# EAGLE design Board v2 (EAGLE 9.6.2)
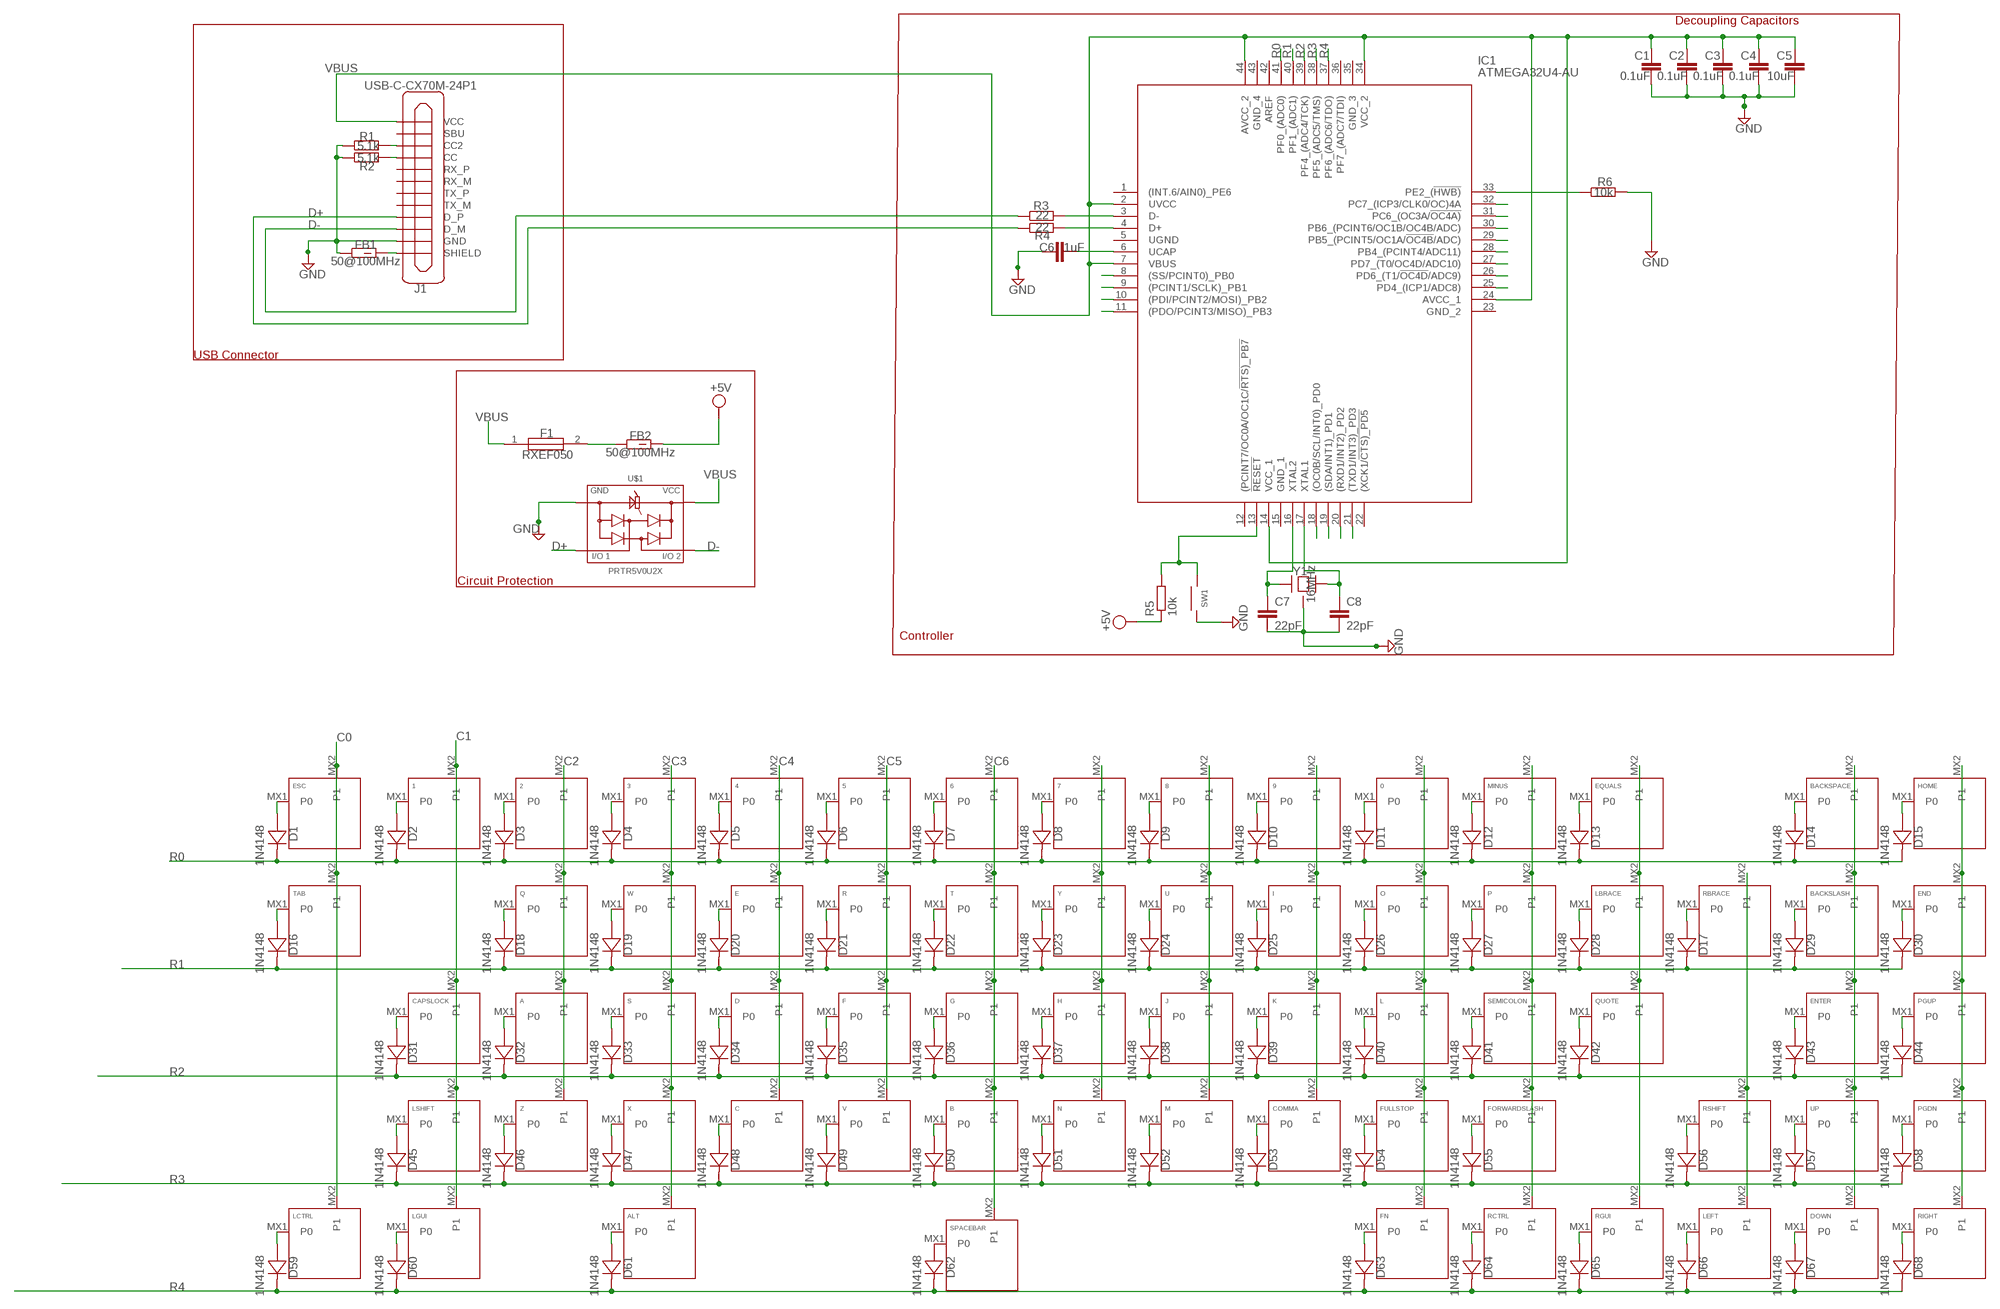
[diagram p0: schematic, sheet 1]

## Parts
0  KEYSWITCH-PLAIN-MX-1U  [MX-1U]
1  KEYSWITCH-PLAIN-MX-1U  [MX-1U]
2  KEYSWITCH-PLAIN-MX-1U  [MX-1U]
3  KEYSWITCH-PLAIN-MX-1U  [MX-1U]
4  KEYSWITCH-PLAIN-MX-1U  [MX-1U]
5  KEYSWITCH-PLAIN-MX-1U  [MX-1U]
6  KEYSWITCH-PLAIN-MX-1U  [MX-1U]
7  KEYSWITCH-PLAIN-MX-1U  [MX-1U]
8  KEYSWITCH-PLAIN-MX-1U  [MX-1U]
9  KEYSWITCH-PLAIN-MX-1U  [MX-1U]
A  KEYSWITCH-PLAIN-MX-1U  [MX-1U]
ALT  KEYSWITCH-PLAIN-MX-1U  [MX-1U]
B  KEYSWITCH-PLAIN-MX-1U  [MX-1U]
BACKSLASH  KEYSWITCH-PLAIN-MX-1U  [MX-1U]
BACKSPACE  KEYSWITCH-PLAIN-MX-2U  [MX-2U]
C  KEYSWITCH-PLAIN-MX-1U  [MX-1U]
C1  0.1uF  C2,5-3  [C2.5-3]
C2  0.1uF  C2,5-3  [C2.5-3]
C3  0.1uF  C2,5-3  [C2.5-3]
C4  0.1uF  C2,5-3  [C2.5-3]
C5  10uF  C2,5-3  [C2.5-3]
C6  1uF  C2,5-3  [C2.5-3]
C7  22pF  C2,5-3  [C2.5-3]
C8  22pF  C2,5-3  [C2.5-3]
CAPSLOCK  KEYSWITCH-PLAIN-MX-2U  [MX-2U]
COMMA  KEYSWITCH-PLAIN-MX-1U  [MX-1U]
D  KEYSWITCH-PLAIN-MX-1U  [MX-1U]
D1  1N4148  DIODE-DO-35  [DO-35]
D2  1N4148  DIODE-DO-35  [DO-35]
D3  1N4148  DIODE-DO-35  [DO-35]
D4  1N4148  DIODE-DO-35  [DO-35]
D5  1N4148  DIODE-DO-35  [DO-35]
D6  1N4148  DIODE-DO-35  [DO-35]
D7  1N4148  DIODE-DO-35  [DO-35]
D8  1N4148  DIODE-DO-35  [DO-35]
D9  1N4148  DIODE-DO-35  [DO-35]
D10  1N4148  DIODE-DO-35  [DO-35]
D11  1N4148  DIODE-DO-35  [DO-35]
D12  1N4148  DIODE-DO-35  [DO-35]
D13  1N4148  DIODE-DO-35  [DO-35]
D14  1N4148  DIODE-DO-35  [DO-35]
D15  1N4148  DIODE-DO-35  [DO-35]
D16  1N4148  DIODE-DO-35  [DO-35]
D17  1N4148  DIODE-DO-35  [DO-35]
D18  1N4148  DIODE-DO-35  [DO-35]
D19  1N4148  DIODE-DO-35  [DO-35]
D20  1N4148  DIODE-DO-35  [DO-35]
D21  1N4148  DIODE-DO-35  [DO-35]
D22  1N4148  DIODE-DO-35  [DO-35]
D23  1N4148  DIODE-DO-35  [DO-35]
D24  1N4148  DIODE-DO-35  [DO-35]
D25  1N4148  DIODE-DO-35  [DO-35]
D26  1N4148  DIODE-DO-35  [DO-35]
D27  1N4148  DIODE-DO-35  [DO-35]
D28  1N4148  DIODE-DO-35  [DO-35]
D29  1N4148  DIODE-DO-35  [DO-35]
D30  1N4148  DIODE-DO-35  [DO-35]
D31  1N4148  DIODE-DO-35  [DO-35]
D32  1N4148  DIODE-DO-35  [DO-35]
D33  1N4148  DIODE-DO-35  [DO-35]
D34  1N4148  DIODE-DO-35  [DO-35]
D35  1N4148  DIODE-DO-35  [DO-35]
D36  1N4148  DIODE-DO-35  [DO-35]
D37  1N4148  DIODE-DO-35  [DO-35]
D38  1N4148  DIODE-DO-35  [DO-35]
D39  1N4148  DIODE-DO-35  [DO-35]
D40  1N4148  DIODE-DO-35  [DO-35]
D41  1N4148  DIODE-DO-35  [DO-35]
D42  1N4148  DIODE-DO-35  [DO-35]
D43  1N4148  DIODE-DO-35  [DO-35]
D44  1N4148  DIODE-DO-35  [DO-35]
D45  1N4148  DIODE-DO-35  [DO-35]
D46  1N4148  DIODE-DO-35  [DO-35]
D47  1N4148  DIODE-DO-35  [DO-35]
D48  1N4148  DIODE-DO-35  [DO-35]
D49  1N4148  DIODE-DO-35  [DO-35]
D50  1N4148  DIODE-DO-35  [DO-35]
D51  1N4148  DIODE-DO-35  [DO-35]
D52  1N4148  DIODE-DO-35  [DO-35]
D53  1N4148  DIODE-DO-35  [DO-35]
D54  1N4148  DIODE-DO-35  [DO-35]
D55  1N4148  DIODE-DO-35  [DO-35]
D56  1N4148  DIODE-DO-35  [DO-35]
D57  1N4148  DIODE-DO-35  [DO-35]
D58  1N4148  DIODE-DO-35  [DO-35]
D59  1N4148  DIODE-DO-35  [DO-35]
D60  1N4148  DIODE-DO-35  [DO-35]
D61  1N4148  DIODE-DO-35  [DO-35]
D62  1N4148  DIODE-DO-35  [DO-35]
D63  1N4148  DIODE-DO-35  [DO-35]
D64  1N4148  DIODE-DO-35  [DO-35]
D65  1N4148  DIODE-DO-35  [DO-35]
D66  1N4148  DIODE-DO-35  [DO-35]
D67  1N4148  DIODE-DO-35  [DO-35]
D68  1N4148  DIODE-DO-35  [DO-35]
DOWN  KEYSWITCH-PLAIN-MX-1U  [MX-1U]
E  KEYSWITCH-PLAIN-MX-1U  [MX-1U]
END  KEYSWITCH-PLAIN-MX-1U  [MX-1U]
ENTER  KEYSWITCH-PLAIN-MX-2U  [MX-2U]
EQUALS  KEYSWITCH-PLAIN-MX-1U  [MX-1U]
ESC  KEYSWITCH-PLAIN-MX-1U  [MX-1U]
F  KEYSWITCH-PLAIN-MX-1U  [MX-1U]
F1  RXEF050  [RXEF050]
FB1  50@100MHz  FB_BLM31PG601SN1L_1206(3216)  [BEADC3216X130N]
FB2  50@100MHz  FB_BLM31PG601SN1L_1206(3216)  [BEADC3216X130N]
FN  KEYSWITCH-PLAIN-MX-1U  [MX-1U]
FORWARDSLASH  KEYSWITCH-PLAIN-MX-1U  [MX-1U]
FULLSTOP  KEYSWITCH-PLAIN-MX-1U  [MX-1U]
G  KEYSWITCH-PLAIN-MX-1U  [MX-1U]
H  KEYSWITCH-PLAIN-MX-1U  [MX-1U]
HOME  KEYSWITCH-PLAIN-MX-1U  [MX-1U]
I  KEYSWITCH-PLAIN-MX-1U  [MX-1U]
IC1  ATMEGA32U4-AU  [QFP80P1200X1200X120-44N]
J  KEYSWITCH-PLAIN-MX-1U  [MX-1U]
J1  USB-C-CX70M-24P1  [CX70M-24P1]
K  KEYSWITCH-PLAIN-MX-1U  [MX-1U]
L  KEYSWITCH-PLAIN-MX-1U  [MX-1U]
LBRACE  KEYSWITCH-PLAIN-MX-1U  [MX-1U]
LCTRL  KEYSWITCH-PLAIN-MX-1U  [MX-1U]
LEFT  KEYSWITCH-PLAIN-MX-1U  [MX-1U]
LGUI  KEYSWITCH-PLAIN-MX-1U  [MX-1U]
LSHIFT  KEYSWITCH-PLAIN-MX-2U  [MX-2U]
M  KEYSWITCH-PLAIN-MX-1U  [MX-1U]
MINUS  KEYSWITCH-PLAIN-MX-1U  [MX-1U]
N  KEYSWITCH-PLAIN-MX-1U  [MX-1U]
O  KEYSWITCH-PLAIN-MX-1U  [MX-1U]
P  KEYSWITCH-PLAIN-MX-1U  [MX-1U]
PGDN  KEYSWITCH-PLAIN-MX-1U  [MX-1U]
PGUP  KEYSWITCH-PLAIN-MX-1U  [MX-1U]
Q  KEYSWITCH-PLAIN-MX-1U  [MX-1U]
QUOTE  KEYSWITCH-PLAIN-MX-1U  [MX-1U]
R  KEYSWITCH-PLAIN-MX-1U  [MX-1U]
R1  5.1k  RESISTOR-THT-SMALL  [THT-RESISTOR-SMALL]
R2  5.1k  RESISTOR-THT-SMALL  [THT-RESISTOR-SMALL]
R3  22  RESISTOR-THT-SMALL  [THT-RESISTOR-SMALL]
R4  22  RESISTOR-THT-SMALL  [THT-RESISTOR-SMALL]
R5  10k  RESISTOR-THT-SMALL  [THT-RESISTOR-SMALL]
R6  10k  RESISTOR-THT-SMALL  [THT-RESISTOR-SMALL]
RBRACE  KEYSWITCH-PLAIN-MX-1U  [MX-1U]
RCTRL  KEYSWITCH-PLAIN-MX-1U  [MX-1U]
RGUI  KEYSWITCH-PLAIN-MX-1U  [MX-1U]
RIGHT  KEYSWITCH-PLAIN-MX-1U  [MX-1U]
RSHIFT  KEYSWITCH-PLAIN-MX-2U  [MX-2U]
S  KEYSWITCH-PLAIN-MX-1U  [MX-1U]
SEMICOLON  KEYSWITCH-PLAIN-MX-1U  [MX-1U]
SPACEBAR  KEYSWITCH-PLAIN-MX-6.25U-FLIPPED  [MX-6.25U-FLIPPED]
SW1  SWITCH-SMD-EVP-BB2A9B00  [SWITCH-SMD-EVP-BB2A9B00]
T  KEYSWITCH-PLAIN-MX-1U  [MX-1U]
TAB  KEYSWITCH-PLAIN-MX-1U  [MX-1U]
U  KEYSWITCH-PLAIN-MX-1U  [MX-1U]
U$1  PRTR5V0U2X  [PRTR5V0U2X]
UP  KEYSWITCH-PLAIN-MX-1U  [MX-1U]
V  KEYSWITCH-PLAIN-MX-1U  [MX-1U]
W  KEYSWITCH-PLAIN-MX-1U  [MX-1U]
X  KEYSWITCH-PLAIN-MX-1U  [MX-1U]
Y  KEYSWITCH-PLAIN-MX-1U  [MX-1U]
Y1  16MHz  CRYSTAL-4PIN-3.2X2.5  [CRYSTAL-3.2X2.5]
Z  KEYSWITCH-PLAIN-MX-1U  [MX-1U]

## Nets
C0: ESC.MX2(P1) IC1.8((SS/PCINT0)_PB0) LCTRL.MX2(P1) TAB.MX2(P1)
C1: 1.MX2(P1) CAPSLOCK.MX2(P1) LGUI.MX2(P1) LSHIFT.MX2(P1)
C2: 2.MX2(P1) A.MX2(P1) Q.MX2(P1) Z.MX2(P1)
C3: 3.MX2(P1) ALT.MX2(P1) S.MX2(P1) W.MX2(P1) X.MX2(P1)
C4: 4.MX2(P1) C.MX2(P1) D.MX2(P1) E.MX2(P1)
C5: 5.MX2(P1) F.MX2(P1) R.MX2(P1) V.MX2(P1)
C6: 6.MX2(P1) B.MX2(P1) G.MX2(P1) SPACEBAR.MX2(P1) T.MX2(P1)
C7: 7.MX2(P1) H.MX2(P1) N.MX2(P1) Y.MX2(P1)
C8: 8.MX2(P1) J.MX2(P1) M.MX2(P1) U.MX2(P1)
C9: 9.MX2(P1) COMMA.MX2(P1) I.MX2(P1) K.MX2(P1)
C10: 0.MX2(P1) FN.MX2(P1) FULLSTOP.MX2(P1) L.MX2(P1) O.MX2(P1)
C11: FORWARDSLASH.MX2(P1) MINUS.MX2(P1) P.MX2(P1) RCTRL.MX2(P1) SEMICOLON.MX2(P1)
C12: EQUALS.MX2(P1) LBRACE.MX2(P1) QUOTE.MX2(P1) RGUI.MX2(P1)
C13: LEFT.MX2(P1) RBRACE.MX2(P1) RSHIFT.MX2(P1)
C14: BACKSLASH.MX2(P1) BACKSPACE.MX2(P1) DOWN.MX2(P1) ENTER.MX2(P1) UP.MX2(P1)
C15: END.MX2(P1) HOME.MX2(P1) PGDN.MX2(P1) PGUP.MX2(P1) RIGHT.MX2(P1)
D+: J1.A6(D_P) J1.B6(D_P) R4.A1 R4.A2 R4.A3 U$1.2
D-: J1.A7(D_M) J1.B7(D_M) R3.A1 R3.A2 R3.A3 U$1.3
GND: C1.2 C2.2 C3.2 C4.2 C5.2 C6.1 C7.2 C8.2 FB1.1 J1.A1(GND) J1.A12(GND) J1.B1(GND) J1.B12(GND) R1.A1 R1.A2 R1.A3 R2.A1 R2.A2 R2.A3 R6.B1 R6.B2 R6.B3 SW1.A@1 SW1.A@2 U$1.1 Y1.2(GND) Y1.4(GND)
N$1: D1.A ESC.MX1(P0)
N$2: 1.MX1(P0) D2.A
N$3: 2.MX1(P0) D3.A
N$4: 3.MX1(P0) D4.A
N$5: 4.MX1(P0) D5.A
N$6: 5.MX1(P0) D6.A
N$7: 6.MX1(P0) D7.A
N$8: 7.MX1(P0) D8.A
N$9: 8.MX1(P0) D9.A
N$10: 9.MX1(P0) D10.A
N$11: 0.MX1(P0) D11.A
N$12: D12.A MINUS.MX1(P0)
N$13: D13.A EQUALS.MX1(P0)
N$14: BACKSPACE.MX1(P0) D14.A
N$15: D15.A HOME.MX1(P0)
N$16: D16.A TAB.MX1(P0)
N$17: D18.A Q.MX1(P0)
N$18: D19.A W.MX1(P0)
N$19: D20.A E.MX1(P0)
N$20: D21.A R.MX1(P0)
N$21: D22.A T.MX1(P0)
N$22: D23.A Y.MX1(P0)
N$23: D24.A U.MX1(P0)
N$24: D25.A I.MX1(P0)
N$25: D26.A O.MX1(P0)
N$26: D27.A P.MX1(P0)
N$27: D28.A LBRACE.MX1(P0)
N$28: BACKSLASH.MX1(P0) D29.A
N$29: D30.A END.MX1(P0)
N$30: CAPSLOCK.MX1(P0) D31.A
N$31: A.MX1(P0) D32.A
N$32: D33.A S.MX1(P0)
N$33: D34.A D.MX1(P0)
N$34: D35.A F.MX1(P0)
N$35: D36.A G.MX1(P0)
N$36: D37.A H.MX1(P0)
N$37: D38.A J.MX1(P0)
N$38: D39.A K.MX1(P0)
N$39: D40.A L.MX1(P0)
N$40: D41.A SEMICOLON.MX1(P0)
N$41: D42.A QUOTE.MX1(P0)
N$42: D43.A ENTER.MX1(P0)
N$43: D44.A PGUP.MX1(P0)
N$44: D45.A LSHIFT.MX1(P0)
N$45: D46.A Z.MX1(P0)
N$46: D47.A X.MX1(P0)
N$47: C.MX1(P0) D48.A
N$48: D49.A V.MX1(P0)
N$49: B.MX1(P0) D50.A
N$50: D51.A N.MX1(P0)
N$51: D52.A M.MX1(P0)
N$52: COMMA.MX1(P0) D53.A
N$53: D54.A FULLSTOP.MX1(P0)
N$54: D55.A FORWARDSLASH.MX1(P0)
N$55: D57.A UP.MX1(P0)
N$56: D58.A PGDN.MX1(P0)
N$57: D56.A RSHIFT.MX1(P0)
N$58: D59.A LCTRL.MX1(P0)
N$59: D60.A LGUI.MX1(P0)
N$60: ALT.MX1(P0) D61.A
N$61: D62.A SPACEBAR.MX1(P0)
N$62: D63.A FN.MX1(P0)
N$63: D64.A RCTRL.MX1(P0)
N$64: D65.A RGUI.MX1(P0)
N$65: D66.A LEFT.MX1(P0)
N$66: D67.A DOWN.MX1(P0)
N$67: D68.A RIGHT.MX1(P0)
N$68: D17.A RBRACE.MX1(P0)
N$69: F1.2 FB2.1
N$70: J1.B5(CC2) R1.B1 R1.B2 R1.B3
N$71: J1.A5(CC) R2.B1 R2.B2 R2.B3
N$72: C6.2 IC1.6(UCAP)
N$73: C7.1 IC1.16(XTAL2) Y1.1
N$74: FB1.2 J1.SHIELD@1(SHIELD) J1.SHIELD@2(SHIELD) J1.SHIELD@3(SHIELD) J1.SHIELD@4(SHIELD)
N$75: IC1.3(D-) R3.B1 R3.B2 R3.B3
N$76: IC1.4(D+) R4.B1 R4.B2 R4.B3
N$77: C8.1 IC1.17(XTAL1) Y1.3
N$78: IC1.32(PC7_(ICP3/CLK0/OC)4A)
N$79: IC1.31(PC6_(OC3A/!OC4A))
N$80: IC1.13(!RESET) R5.B1 R5.B2 R5.B3 SW1.B@3 SW1.B@4
N$81: IC1.33(PE2_(!HWB)) R6.A1 R6.A2 R6.A3
N$82: IC1.30(PB6_(PCINT6/OC1B/OC4B/ADC))
N$83: IC1.29(PB5_(PCINT5/OC1A/!OC4B!/ADC))
N$84: IC1.28(PB4_(PCINT4/ADC11))
N$85: IC1.27(PD7_(T0/OC4D/ADC10))
N$86: IC1.26(PD6_(T1/!OC4D!/ADC9))
N$87: IC1.25(PD4_(ICP1/ADC8))
N$89: IC1.9((PCINT1/SCLK)_PB1)
N$90: IC1.10((PDI/PCINT2/MOSI)_PB2)
N$91: IC1.11((PDO/PCINT3/MISO)_PB3)
N$92: IC1.18((OC0B/SCL/INT0)_PD0)
N$93: IC1.19((SDA/INT1)_PD1)
N$94: IC1.20((RXD1/INT2)_PD2)
N$95: IC1.21((TXD1/INT3)_PD3)
R0: D1.C D2.C D3.C D4.C D5.C D6.C D7.C D8.C D9.C D10.C D11.C D12.C D13.C D14.C D15.C IC1.41(PF0_(ADC0))
R1: D16.C D17.C D18.C D19.C D20.C D21.C D22.C D23.C D24.C D25.C D26.C D27.C D28.C D29.C D30.C IC1.40(PF1_(ADC1))
R2: D31.C D32.C D33.C D34.C D35.C D36.C D37.C D38.C D39.C D40.C D41.C D42.C D43.C D44.C IC1.39(PF4_(ADC4/TCK))
R3: D45.C D46.C D47.C D48.C D49.C D50.C D51.C D52.C D53.C D54.C D55.C D56.C D57.C D58.C IC1.38(PF5_(ADC5/TMS))
R4: D59.C D60.C D61.C D62.C D63.C D64.C D65.C D66.C D67.C D68.C IC1.37(PF6_(ADC6/TDO))
VBUS: C1.1 C2.1 C3.1 C4.1 C5.1 F1.1 IC1.2(UVCC) IC1.7(VBUS) IC1.14(VCC_1) IC1.24(AVCC_1) IC1.34(VCC_2) IC1.44(AVCC_2) J1.A4(VCC) J1.A9(VCC) J1.B4(VCC) J1.B9(VCC) U$1.4
VCC: FB2.2 R5.A1 R5.A2 R5.A3 ; supply symbol labelled +5V
Unconnected: IC1.1((INT.6/AIN0)_PE6) IC1.5(UGND) IC1.12((PCINT7/OC0A/OC1C/!RTS)_PB7) IC1.15(GND_1) IC1.22((XCK1/!CTS)_PD5) IC1.23(GND_2) IC1.35(GND_3) IC1.36(PF7_(ADC7/TDI)) IC1.42(AREF) IC1.43(GND_4) J1.A2(TX_P) J1.A3(TX_M) J1.A8(SBU) J1.A10(RX_M) J1.A11(RX_P) J1.B2(TX_P) J1.B3(TX_M) J1.B8(SBU) J1.B10(RX_M) J1.B11(RX_P)

## Notes on the sheet
- Decoupling Capacitors
- USB Connector
- Circuit Protection
- Controller

## Library data of the parts
0 1-9 A ALT B BACKSLASH BACKSPACE C CAPSLOCK COMMA D DOWN E END ENTER EQUALS ESC F FN FORWARDSLASH FULLSTOP G H HOME I J K L LBRACE LCTRL LEFT LGUI LSHIFT M MINUS N O P PGDN PGUP Q QUOTE R RBRACE RCTRL RGUI RIGHT RSHIFT S SEMICOLON SPACEBAR T TAB U UP V W X Y Z = Keyboard:KEYSWITCH-PLAIN
C1-C8 = capacitor-wima:C: CAPACITOR naming: grid - package width
D1-D68 = Components:DIODE: Standard 1N4148 diode
F1 = RXEF050:RXEF050: PolySwitch PTC Devices Overcurrent Protection Device, Resettable Fuses - PPTC Radial Lead .5A 72V 40A Source: Datasheet <http://www.littelfuse.com/~/media/electronics/product_specifications/resettable_ptcs/littelfuse_ptc_rxef050_product_specification.pdf.pdf>; ARROW_PART_NUMBER: RXEF050; ARROW_PRICE-STOCK: https://www.arrow.com/en/products/rxef050/littelfuse; DESCRIPTION: PolySwitch PTC Devices Overcurrent Protection Device, Resettable Fuses - PPTC Radial Lead .5A 72V 40A; HEIGHT: mm; MANUFACTURER_NAME: LITTELFUSE; MANUFACTURER_PART_NUMBER: RXEF050; MOUSER_PART_NUMBER: 650-RXEF050; MOUSER_PRICE-STOCK: https://www.mouser.co.uk/ProductDetail/Littelfuse/RXEF050?qs=k5V78Jg%2Feq7BserVMEB6DA%3D%3D
FB1 FB2 = Filter:FB_: Ferrite Bead - Popular parts; CATEGORY: Filter; DESCRIPTION: FERRITE BEAD 600 OHM 1206 1LN; MANUFACTURER: Murata Electronics; SUB-CATEGORY: Ferrite bead; VALUE: BLM31PG601
IC1 = ATMEGA32U4-AU:ATMEGA32U4-AU: MCU AVR 32K FLASH 16MHZ 44-TQFP Atmel ATMEGA32U4-AU, 8bit AVR Microcontroller, 16MHz, 1 kB, 32 kB Flash, 44-Pin TQFP Source: Datasheet <http://www.atmel.com/images/atmel-7766-8-bit-avr-atmega16u4-32u4_summary.pdf>; ARROW_PART_NUMBER: ATMEGA32U4-AU; ARROW_PRICE-STOCK: https://www.arrow.com/en/products/atmega32u4-au/microchip-technology; DESCRIPTION: MCU AVR 32K FLASH 16MHZ 44-TQFP Atmel ATMEGA32U4-AU, 8bit AVR Microcontroller, 16MHz, 1 kB, 32 kB Flash, 44-Pin TQFP; HEIGHT: 1.2mm; MANUFACTURER_NAME: Microchip; MANUFACTURER_PART_NUMBER: ATMEGA32U4-AU; MOUSER_PART_NUMBER: 556-ATMEGA32U4-AU; MOUSER_PRICE-STOCK: https://www.mouser.co.uk/ProductDetail/Microchip-Technology-Atmel/ATMEGA32U4-AU/?qs=SSucg2PyLi7mKWjHIsNJ3w%3D%3D
J1 = Controller:USB-C
R1-R6 = Components:RESISTOR
SW1 = Controller:SWITCH-SMD
U$1 = Controller:PRTR5V0U2X
Y1 = Components:CRYSTAL-4PIN

## Board
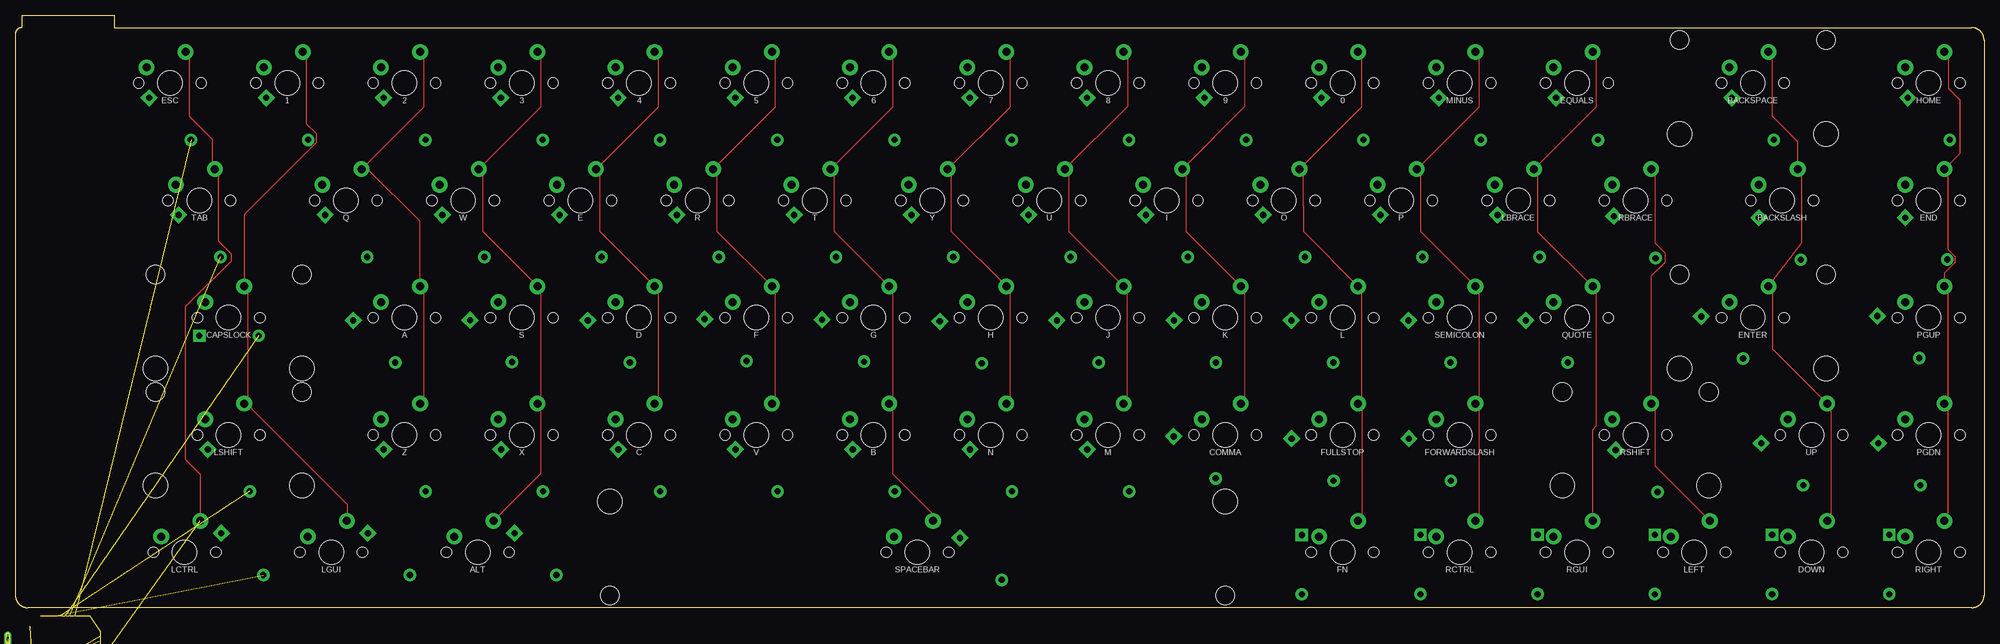
[diagram p1: board, top side]
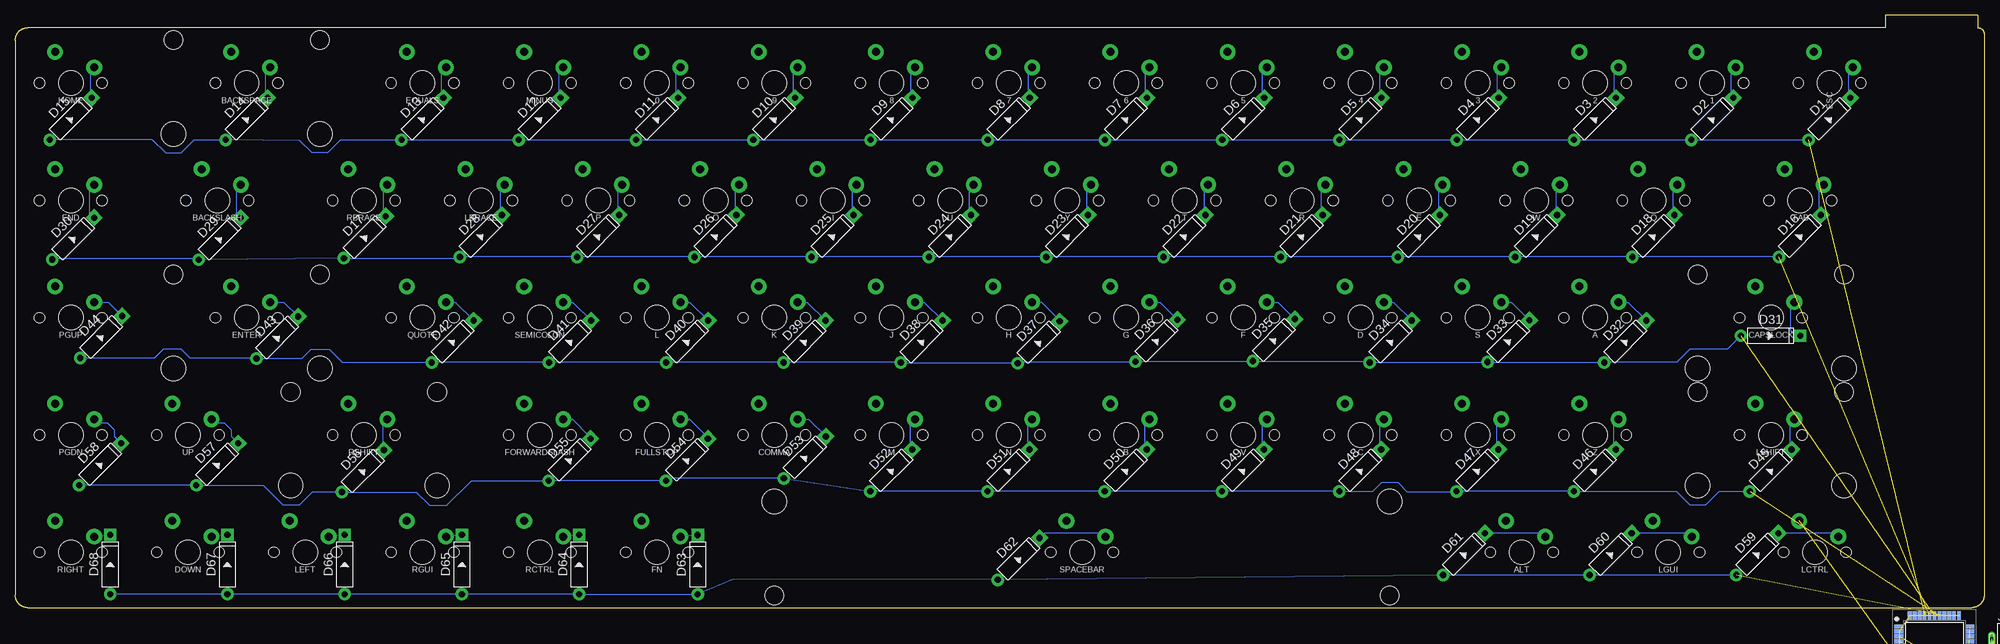
[diagram p2: board, bottom side, seen from below]

Size 319.87 x 96.2 mm. Coordinates in mm from the lower left corner, seen from the top.
Outline: 319.87,92.2 319.87,2 319.87,1.97 319.87,1.93 319.87,1.9 319.87,1.86 319.86,1.83 319.86,1.79 319.85,1.76 319.85,1.72 319.85,1.69 319.84,1.65 319.83,1.62 319.83,1.58 319.82,1.55 319.81,1.52 319.8,1.48 319.79,1.45 319.78,1.42 319.77,1.38 319.76,1.35 319.75,1.32 319.74,1.28 319.72,1.25 319.71,1.22 319.7,1.19 319.68,1.16 319.67,1.12 319.65,1.09 319.64,1.06 319.62,1.03 319.6,1 319.58,0.97 319.57,0.94 319.55,0.91 319.53,0.88 319.51,0.85 319.49,0.82 319.47,0.8 319.45,0.77 319.42,0.74 319.4,0.71 319.38,0.69 319.36,0.66 319.33,0.64 319.31,0.61 319.28,0.59 319.26,0.56 319.23,0.54 319.21,0.51 319.18,0.49 319.16,0.47 319.13,0.45 319.1,0.42 319.07,0.4 319.05,0.38 319.02,0.36 318.99,0.34 318.96,0.32 318.93,0.3 318.9,0.29 318.87,0.27 318.84,0.25 318.81,0.23 318.78,0.22 318.75,0.2 318.72,0.19 318.68,0.17 318.65,0.16 318.62,0.15 318.59,0.13 318.55,0.12 318.52,0.11 318.49,0.1 318.45,0.09 318.42,0.08 318.39,0.07 318.35,0.06 318.32,0.05 318.29,0.04 318.25,0.04 318.22,0.03 318.18,0.02 318.15,0.02 318.11,0.02 318.08,0.01 318.04,0.01 318.01,0.01 317.97,0 317.94,0 317.9,0 317.87,0 2,0 1.97,0 1.93,0 1.9,0 1.86,0.01 1.83,0.01 1.79,0.01 1.76,0.02 1.72,0.02 1.69,0.02 1.65,0.03 1.62,0.04 1.58,0.04 1.55,0.05 1.52,0.06 1.48,0.07 1.45,0.08 1.42,0.09 1.38,0.1 1.35,0.11 1.32,0.12 1.28,0.13 1.25,0.15 1.22,0.16 1.19,0.17 1.16,0.19 1.12,0.2 1.09,0.22 1.06,0.23 1.03,0.25 1,0.27 0.97,0.29 0.94,0.3 0.91,0.32 0.88,0.34 0.85,0.36 0.82,0.38 0.8,0.4 0.77,0.42 0.74,0.45 0.71,0.47 0.69,0.49 0.66,0.51 0.64,0.54 0.61,0.56 0.59,0.59 0.56,0.61 0.54,0.64 0.51,0.66 0.49,0.69 0.47,0.71 0.45,0.74 0.42,0.77 0.4,0.8 0.38,0.82 0.36,0.85 0.34,0.88 0.32,0.91 0.3,0.94 0.29,0.97 0.27,1 0.25,1.03 0.23,1.06 0.22,1.09 0.2,1.12 0.19,1.16 0.17,1.19 0.16,1.22 0.15,1.25 0.13,1.28 0.12,1.32 0.11,1.35 0.1,1.38 0.09,1.42 0.08,1.45 0.07,1.48 0.06,1.52 0.05,1.55 0.04,1.58 0.04,1.62 0.03,1.65 0.03,1.69 0.02,1.72 0.02,1.76 0.01,1.79 0.01,1.83 0.01,1.86 0,1.9 0,1.93 0,1.97 0,2 0,93.2 0,93.22 0,93.24 0,93.25 0,93.27 0,93.29 0.01,93.31 0.01,93.32 0.01,93.34 0.01,93.36 0.02,93.37 0.02,93.39 0.02,93.41 0.03,93.43 0.03,93.44 0.03,93.46 0.04,93.48 0.04,93.49 0.05,93.51 0.05,93.53 0.06,93.54 0.07,93.56 0.07,93.58 0.08,93.59 0.09,93.61 0.09,93.62 0.1,93.64 0.11,93.65 0.12,93.67 0.13,93.69 0.13,93.7 0.14,93.72 0.15,93.73 0.16,93.75 0.17,93.76 0.18,93.77 0.19,93.79 0.2,93.8 0.21,93.82 0.22,93.83 0.23,93.84 0.25,93.86 0.26,93.87 0.27,93.88 0.28,93.9 0.29,93.91 0.31,93.92 0.32,93.93 0.33,93.94 0.34,93.96 0.36,93.97 0.37,93.98 0.38,93.99 0.4,94 0.41,94.01 0.43,94.02 0.44,94.03 0.46,94.04 0.47,94.05 0.49,94.06 0.5,94.07 0.52,94.08 0.53,94.08 0.55,94.09 0.56,94.1 0.58,94.11 0.59,94.11 0.61,94.12 0.63,94.13 0.64,94.13 0.66,94.14 0.67,94.15 0.69,94.15 0.71,94.16 0.72,94.16 0.74,94.17 0.76,94.17 0.78,94.17 0.79,94.18 0.81,94.18 0.83,94.19 0.84,94.19 0.86,94.19 0.88,94.19 0.9,94.2 0.91,94.2 0.93,94.2 0.95,94.2 0.97,94.2 0.98,94.2 1,94.2 1.07,94.2 1.07,96.2 16.07,96.2 16.07,94.2 317.87,94.2 317.9,94.2 317.94,94.2 317.97,94.2 318.01,94.2 318.04,94.19 318.08,94.19 318.11,94.19 318.15,94.18 318.18,94.18 318.22,94.17 318.25,94.16 318.29,94.16 318.32,94.15 318.35,94.14 318.39,94.13 318.42,94.12 318.45,94.11 318.49,94.1 318.52,94.09 318.55,94.08 318.59,94.07 318.62,94.05 318.65,94.04 318.68,94.03 318.72,94.01 318.75,94 318.78,93.98 318.81,93.97 318.84,93.95 318.87,93.93 318.9,93.91 318.93,93.9 318.96,93.88 318.99,93.86 319.02,93.84 319.05,93.82 319.07,93.8 319.1,93.78 319.13,93.75 319.16,93.73 319.18,93.71 319.21,93.69 319.23,93.66 319.26,93.64 319.28,93.61 319.31,93.59 319.33,93.56 319.36,93.54 319.38,93.51 319.4,93.49 319.42,93.46 319.45,93.43 319.47,93.4 319.49,93.38 319.51,93.35 319.53,93.32 319.55,93.29 319.57,93.26 319.58,93.23 319.6,93.2 319.62,93.17 319.64,93.14 319.65,93.11 319.67,93.08 319.68,93.05 319.7,93.01 319.71,92.98 319.72,92.95 319.74,92.92 319.75,92.88 319.76,92.85 319.77,92.82 319.78,92.79 319.79,92.75 319.8,92.72 319.81,92.68 319.82,92.65 319.83,92.62 319.83,92.58 319.84,92.55 319.85,92.51 319.85,92.48 319.85,92.44 319.86,92.41 319.86,92.37 319.87,92.34 319.87,92.31 319.87,92.27 319.87,92.24 319.87,92.2
Copper layers (1*16): Top 0.035mm / dielectric 1.5mm / Bottom 0.035mm
Design rules "default": minimum track width 6mil, minimum drill 0.35mm, track to track 6mil, track to pad 6mil, pad to pad 6mil, via to via 6mil, smd to smd 6mil, copper to edge 40mil, drill to drill 6mil, minimum pad ring 10mil, minimum via ring 8mil, stop-mask expansion 4mil, vias tented up to drill 0mil, thermal gap 10mil

### Footprints (pad centres in the part's own frame; a part is rotated, then mirrored left to right if it is on the bottom)
MX-1U = drill 1.3 pad 2.54: MX1 -3.81,2.54; MX2 2.54,5.08 | hole 4: 0,0 | hole 1.7: -5.08,0; 5.08,0
MX-2U = drill 1.3 pad 2.54: MX1 -3.81,2.54; MX2 2.54,5.08 | hole 4: 0,0; -11.9,-8.24; 11.9,-8.24 | hole 1.7: -5.08,0; 5.08,0 | hole 3.05: -11.9,7; 11.9,7
C2.5-3 = drill 0.813 pad 1.6 octagon: 1 -1.27,0; 2 1.27,0
DO-35 = drill 1 pad 2 square: A 4.82,0 | drill 1 pad 2: C -4.82,0
RXEF050 = drill 0.71 pad 1.21: 1 -2.525,0; 2 2.525,0
BEADC3216X130N = smd 1.165 x 1.815: 1 -1.475,0; 2 1.475,0
QFP80P1200X1200X120-44N = smd 1.5 x 0.6: 1 -5.75,4; 2 -5.75,3.2; 3 -5.75,2.4; 4 -5.75,1.6; 5 -5.75,0.8; 6 -5.75,0; 7 -5.75,-0.8; 8 -5.75,-1.6; 9 -5.75,-2.4; 10 -5.75,-3.2; 11 -5.75,-4; 23 5.75,-4; 24 5.75,-3.2; 25 5.75,-2.4; 26 5.75,-1.6; 27 5.75,-0.8; 28 5.75,0; 29 5.75,0.8; 30 5.75,1.6; 31 5.75,2.4; 32 5.75,3.2; 33 5.75,4 | smd 0.6 x 1.5: 12 -4,-5.75; 13 -3.2,-5.75; 14 -2.4,-5.75; 15 -1.6,-5.75; 16 -0.8,-5.75; 17 0,-5.75; 18 0.8,-5.75; 19 1.6,-5.75; 20 2.4,-5.75; 21 3.2,-5.75; 22 4,-5.75; 34 4,5.75; 35 3.2,5.75; 36 2.4,5.75; 37 1.6,5.75; 38 0.8,5.75; 39 0,5.75; 40 -0.8,5.75; 41 -1.6,5.75; 42 -2.4,5.75; 43 -3.2,5.75; 44 -4,5.75
CX70M-24P1 = smd 0.23 x 0.85: A1 2.2,-8; A2 1.8,-8; A3 1.4,-8; A4 1,-8; A5 0.6,-8; A6 0.2,-8; A7 -0.2,-8; A8 -0.6,-8; A9 -1,-8; A10 -1.4,-8; A11 -1.8,-8; A12 -2.2,-8; B1 -3.4,-8; B2 -3,-8; B3 -2.6,-8; B10 2.6,-8; B11 3,-8; B12 3.4,-8 | drill 0.4 pad 0.6: B4 -2,-7.075; B5 -1.2,-7.075; B6 -0.4,-7.075; B7 0.4,-7.075; B8 1.2,-7.075; B9 2,-7.075 | smd 0.46 x 0.85: NC@1 -3.915,-8; NC@2 3.915,-8 | drill 0.6 pad 1.2 long: SHIELD@1 6.2,-7.575; SHIELD@2 -6.2,-7.575; SHIELD@3 6.2,-2.525; SHIELD@4 -6.2,-2.525
THT-RESISTOR-SMALL = drill 1 pad 1.9: A1 -3.5,0; B1 3.5,0 | smd 1.397 x 1.397: A2 -1.651,0; B2 1.651,0 | smd 1.397 x 1.397 bottom: A3 -1.651,0; B3 1.651,0
MX-6.25U-FLIPPED = drill 1.3 pad 2.54: MX1 -3.81,2.54; MX2 2.54,5.08 | hole 4: 0,0; -50,8.24; 50,8.24 | hole 1.7: -5.08,0; 5.08,0 | hole 3.05: -50,-7; 50,-7
SWITCH-SMD-EVP-BB2A9B00 = smd 0.95 x 0.55: A@1 -1.6,0.6; A@2 -1.6,-0.6; B@3 1.6,0.6; B@4 1.6,-0.6
PRTR5V0U2X = smd 1 x 0.6: 1 -0.75,-0.95 | smd 0.6 x 0.6: 2 0.95,-0.95; 3 0.95,0.95; 4 -0.95,0.95
CRYSTAL-3.2X2.5 = smd 1.3 x 1.05: 1 -1.15,-0.925; 2 1.15,-0.925; 3 1.15,0.925; 4 -1.15,0.925

### Placement (x,y rotation side)
0  215.62,85.2 0 top
1  44.17,85.2 0 top
2  63.22,85.2 0 top
3  82.27,85.2 0 top
4  101.32,85.2 0 top
5  120.37,85.2 0 top
6  139.42,85.2 0 top
7  158.47,85.2 0 top
8  177.52,85.2 0 top
9  196.57,85.2 0 top
A  63.22,47.1 0 top
ALT  75.13,9 0 top
B  139.42,28.05 0 top
BACKSLASH  287.06,66.15 0 top
BACKSPACE  282.29,85.2 0 top
C  101.32,28.05 0 top
C1  1.57,-33.05 0 bottom  (outside the outline)
C2  -4.43,-33.05 0 bottom  (outside the outline)
C3  -10.43,-33.05 0 bottom  (outside the outline)
C4  -16.43,-33.05 0 bottom  (outside the outline)
C5  13.57,-40.55 0 bottom  (outside the outline)
C6  -2.93,-40.55 0 bottom  (outside the outline)
C7  8.07,-40.55 0 bottom  (outside the outline)
C8  2.57,-40.55 0 bottom  (outside the outline)
CAPSLOCK  34.64,47.1 0 top
COMMA  196.57,28.05 0 top
D  101.32,47.1 0 top
D1  25.13,79.39 45 bottom
D2  44.18,79.39 45 bottom
D3  63.23,79.39 45 bottom
D4  82.28,79.39 45 bottom
D5  101.33,79.39 45 bottom
D6  120.38,79.39 45 bottom
D7  139.43,79.39 45 bottom
D8  158.48,79.39 45 bottom
D9  177.53,79.39 45 bottom
D10  196.58,79.39 45 bottom
D11  215.63,79.39 45 bottom
D12  234.68,79.39 45 bottom
D13  253.73,79.39 45 bottom
D14  282.3,79.39 45 bottom
D15  310.88,79.39 45 bottom
D16  29.92,60.37 45 bottom
D17  263.09,60.19 45 bottom
D18  53.73,60.37 45 bottom
D19  72.78,60.37 45 bottom
D20  91.83,60.37 45 bottom
D21  110.88,60.37 45 bottom
D22  129.93,60.37 45 bottom
D23  148.98,60.37 45 bottom
D24  168.03,60.37 45 bottom
D25  187.08,60.37 45 bottom
D26  206.13,60.37 45 bottom
D27  225.18,60.37 45 bottom
D28  244.23,60.37 45 bottom
D29  286.69,59.92 45 bottom
D30  310.47,59.95 45 bottom
D31  34.71,44.15 0 bottom
D32  58.31,43.24 45 bottom
D33  77.28,43.3 45 bottom
D34  96.41,43.24 45 bottom
D35  115.4,43.47 45 bottom
D36  134.47,43.37 45 bottom
D37  153.6,43.1 45 bottom
D38  172.61,43.24 45 bottom
D39  191.66,43.24 45 bottom
D40  210.71,43.24 45 bottom
D41  229.76,43.24 45 bottom
D42  248.81,43.24 45 bottom
D43  277.31,43.89 45 bottom
D44  305.94,43.95 45 bottom
D45  34.69,22.29 45 bottom
D46  63.26,22.29 45 bottom
D47  82.31,22.29 45 bottom
D48  101.36,22.29 45 bottom
D49  120.41,22.29 45 bottom
D50  139.46,22.29 45 bottom
D51  158.51,22.29 45 bottom
D52  177.56,22.29 45 bottom
D53  191.61,24.4 45 bottom
D54  210.77,24.03 45 bottom
D55  229.82,24.03 45 bottom
D56  263.41,22.19 45 bottom
D57  287.06,23.29 45 bottom
D58  306.11,23.29 45 bottom
D59  36.87,8.7 45 bottom
D60  60.68,8.7 45 bottom
D61  84.49,8.7 45 bottom
D62  156.86,7.91 45 bottom
D63  209.01,6.98 90 bottom
D64  228.27,7.02 90 bottom
D65  247.32,7.02 90 bottom
D66  266.37,7.02 90 bottom
D67  285.42,7.02 90 bottom
D68  304.47,7.02 90 bottom
DOWN  291.82,9 0 top
E  91.79,66.15 0 top
END  310.87,66.15 0 top
ENTER  282.29,47.1 0 top
EQUALS  253.72,85.2 0 top
ESC  25.12,85.2 0 top
F  120.37,47.1 0 top
F1  -5.93,-46.05 0 bottom  (outside the outline)
FB1  -8.43,-25.55 0 bottom  (outside the outline)
FB2  10.07,-33.05 0 bottom  (outside the outline)
FN  215.62,9 0 top
FORWARDSLASH  234.67,28.05 0 top
FULLSTOP  215.62,28.05 0 top
G  139.42,47.1 0 top
H  158.47,47.1 0 top
HOME  310.87,85.2 0 top
I  187.04,66.15 0 top
IC1  8.07,-7.05 0 bottom
J  177.52,47.1 0 top
J1  -7.43,-2.55 0 bottom  (outside the outline)
K  196.57,47.1 0 top
L  215.62,47.1 0 top
LBRACE  244.19,66.15 0 top
LCTRL  27.5,9 0 top
LEFT  272.77,9 0 top
LGUI  51.31,9 0 top
LSHIFT  34.64,28.05 0 top
M  177.52,28.05 0 top
MINUS  234.67,85.2 0 top
N  158.47,28.05 0 top
O  206.09,66.15 0 top
P  225.14,66.15 0 top
PGDN  310.87,28.05 0 top
PGUP  310.87,47.1 0 top
Q  53.69,66.15 0 top
QUOTE  253.72,47.1 0 top
R  110.84,66.15 0 top
R1  11.57,-18.05 0 bottom  (outside the outline)
R2  2.07,-18.05 0 bottom  (outside the outline)
R3  -7.43,-18.05 0 bottom  (outside the outline)
R4  -16.93,-18.05 0 bottom  (outside the outline)
R5  11.57,-25.55 0 bottom  (outside the outline)
R6  2.07,-25.55 0 bottom  (outside the outline)
RBRACE  263.24,66.15 0 top
RCTRL  234.67,9 0 top
RGUI  253.72,9 0 top
RIGHT  310.87,9 0 top
RSHIFT  263.24,28.05 0 top
S  82.27,47.1 0 top
SEMICOLON  234.67,47.1 0 top
SPACEBAR  146.56,9 0 top
SW1  1.57,-45.55 0 bottom  (outside the outline)
T  129.89,66.15 0 top
TAB  29.88,66.15 0 top
U  167.99,66.15 0 top
U$1  10.07,-47.55 0 bottom  (outside the outline)
UP  291.82,28.05 0 top
V  120.37,28.05 0 top
W  72.74,66.15 0 top
X  82.27,28.05 0 top
Y  148.94,66.15 0 top
Y1  -8.93,-40.55 0 bottom  (outside the outline)
Z  63.22,28.05 0 top

### Tracks (layer width: path | path; a pad name or v marks a point on that pad's centre or on a via)
C0  (1 unrouted)
  Top 0.152: LCTRL.MX2 30.06,14.1 30.06,21.64 27.62,24.08 27.62,48.84 35.05,56.26 35.05,57.52 32.97,59.59 32.97,70.68 TAB.MX2 32.19,71.23 31.95,71.47 31.95,76.05 28.21,79.79 28.21,89.73 ESC.MX2
C1
  Top 0.152: 1.MX2 47.26,89.73 47.26,78.62 48.84,77.04 48.84,75.48 37.19,63.83 CAPSLOCK.MX2 37.74,51.63 37.74,33.68 LSHIFT.MX2 37.61,33.13 53.93,16.81 53.93,14.16 LGUI.MX2
C2
  Top 0.152: Z.MX2 66.31,33.68 66.31,51.63 A.MX2 65.76,62.73 57.26,71.23 Q.MX2 | 2.MX2 66.31,89.73 66.31,81.31 Q.MX2 | Q.MX2 | Q.MX2
C3
  Top 0.152: 3.MX2 85.36,89.73 85.36,81.31 W.MX2 75.88,70.64 75.88,65.34 75.88,61.11 S.MX2 85.36,51.63 85.36,33.68 X.MX2 85.36,32.58 85.36,21.78 ALT.MX2
C4
  Top 0.152: 4.MX2 104.41,89.73 104.41,81.31 E.MX2 94.89,70.68 94.89,61.15 D.MX2 104.41,51.63 104.41,33.68 C.MX2
C5
  Top 0.152: V.MX2 123.47,33.69 123.47,51.62 F.MX2 113.94,61.15 113.94,70.68 R.MX2 123.46,81.31 123.46,81.38 123.46,89.73 5.MX2
C6
  Top 0.152: 6.MX2 142.51,89.73 142.51,81.31 T.MX2 132.99,70.68 132.99,61.15 G.MX2 142.51,51.63 142.51,33.68 B.MX2 142.51,32.58 142.51,21.75 149.1,15.16 SPACEBAR.MX2
C7
  Top 0.152: 7.MX2 161.57,89.72 161.57,81.32 Y.MX2 152.06,70.66 152.06,61.13 H.MX2 161.56,51.63 161.56,33.68 N.MX2
C8
  Top 0.152: 8.MX2 180.65,89.69 180.65,81.37 170.53,71.25 U.MX2 | U.MX2 | U.MX2 171.1,70.67 171.1,61.14 J.MX2 180.64,51.6 180.64,33.71 M.MX2
C9
  Top 0.152: 9.MX2 199.71,89.68 199.71,81.35 I.MX2 190.17,70.65 190.17,61.12 K.MX2 199.67,51.62 199.67,33.69 COMMA.MX2
C10
  Top 0.152: 0.MX2 218.71,89.73 218.71,81.31 O.MX2 209.23,70.63 209.23,65.35 209.24,65.34 209.24,61.1 L.MX2 218.72,51.62 218.72,33.69 FULLSTOP.MX2 218.74,32.55 218.74,14.66 FN.MX2
C11
  Top 0.152: MINUS.MX2 237.76,89.73 237.76,81.31 P.MX2 228.28,70.63 228.28,61.1 SEMICOLON.MX2 237.76,51.63 237.76,33.68 FORWARDSLASH.MX2 237.79,32.55 237.79,14.66 RCTRL.MX2
C12
  Top 0.152: EQUALS.MX2 256.81,89.73 256.81,81.31 LBRACE.MX2 247.32,70.64 247.32,61.07 256.21,52.18 QUOTE.MX2 256.81,51.63 256.81,29.44 256.2,28.84 256.2,14.14 RGUI.MX2
C13
  Top 0.152: RBRACE.MX2 266.36,70.66 266.36,59.24 267.97,57.63 267.97,56.05 265.74,53.83 265.74,33.17 RSHIFT.MX2 266.35,32.57 266.35,23.04 LEFT.MX2
C14
  Top 0.152: BACKSPACE.MX2 285.39,89.73 285.39,79.93 289.54,75.78 289.54,71.29 BACKSLASH.MX2 290.15,70.68 290.15,59.19 290.16,59.17 ENTER.MX2 285.42,51.6 285.42,42.07 UP.MX2 294.94,32.55 294.94,14.66 DOWN.MX2
C15
  Top 0.152: HOME.MX2 314.01,89.68 314.01,84.4 315.92,82.48 315.92,73.75 END.MX2 313.96,70.68 313.96,58.2 315.11,57.05 315.11,56 313.41,54.3 313.41,53.34 PGUP.MX2 313.96,51.63 313.96,33.68 PGDN.MX2 313.96,32.58 313.96,14.63 RIGHT.MX2
D+  (5 unrouted)
D-  (5 unrouted)
GND  (26 unrouted)
N$1
  Bottom 0.152: ESC.MX1 22,87.05 22,83.08 D1.A
N$2
  Bottom 0.152: 1.MX1 41.04,87.06 41.04,83.07 D2.A
N$3
  Bottom 0.152: 2.MX1 60.1,87.05 60.1,83.08 D3.A
N$4
  Bottom 0.152: 3.MX1 79.15,87.05 79.15,83.08 D4.A
N$5
  Bottom 0.152: 4.MX1 98.19,87.06 98.19,83.25 98.2,83.25 98.2,83.07 D5.A
N$6
  Bottom 0.152: 5.MX1 117.25,87.05 117.25,83.2 | D6.A 117.25,83.08 117.25,83.2 | 117.25,83.2
N$7
  Bottom 0.152: 6.MX1 136.31,87.04 136.31,83.09 D7.A
N$8
  Bottom 0.152: 7.MX1 155.34,87.06 155.34,83.07 D8.A
N$9
  Bottom 0.152: 8.MX1 174.39,87.06 174.39,83.3 174.39,83.07 D9.A
N$10
  Bottom 0.152: 9.MX1 193.45,87.05 193.45,83.22 193.45,83.08 D10.A
N$11
  Bottom 0.152: 0.MX1 212.49,87.06 212.49,83.24 212.49,83.07 D11.A
N$12
  Bottom 0.152: MINUS.MX1 231.55,87.05 231.55,83.08 D12.A
N$13
  Bottom 0.152: EQUALS.MX1 250.6,87.05 250.6,83.13 250.6,83.08 D13.A
N$14
  Bottom 0.152: BACKSPACE.MX1 279.18,87.04 279.18,83.16 279.18,83.09 D14.A
N$15
  Bottom 0.152: HOME.MX1 307.75,87.05 307.75,83.08 D15.A
N$16
  Bottom 0.152: TAB.MX1 26.79,67.98 26.79,64.17 26.78,64.17 26.78,64.05 D16.A
N$17
  Bottom 0.152: Q.MX1 50.56,68.02 50.56,64.01 D18.A
N$18
  Bottom 0.152: W.MX1 69.61,68.01 69.61,64.02 D19.A
N$19
  Bottom 0.152: E.MX1 88.7,67.98 88.7,64.05 D20.A
N$20
  Bottom 0.152: R.MX1 107.73,68 107.73,64.03 D21.A
N$21
  Bottom 0.152: T.MX1 126.78,67.99 126.78,64.03 D22.A
N$22
  Bottom 0.152: Y.MX1 145.81,68.02 145.81,64.01 D23.A
N$23
  Bottom 0.152: U.MX1 164.89,67.98 164.89,64.04 D24.A
N$24
  Bottom 0.152: I.MX1 183.92,68.01 183.92,64.02 D25.A
N$25
  Bottom 0.152: O.MX1 202.98,68 202.98,64.03 D26.A
N$26
  Bottom 0.152: P.MX1 222.03,67.99 222.03,64.03 D27.A
N$27
  Bottom 0.152: LBRACE.MX1 241.09,67.99 241.09,64.04 D28.A
N$28
  Bottom 0.152: BACKSLASH.MX1 283.93,68.01 283.93,63.67 283.58,63.33 D29.A
N$29
  Bottom 0.152: END.MX1 307.75,68 307.75,63.77 307.34,63.35 D30.A
N$30
  Bottom 0.152: CAPSLOCK.MX1 31.51,48.97 31.51,45.02 30.63,44.15 D31.A
N$31
  Bottom 0.152: A.MX1 57.9,49.64 D32.A
N$32
  Bottom 0.152: S.MX1 76.8,49.64 D33.A
N$33
  Bottom 0.152: D.MX1 96,49.64 D34.A
N$34
  Bottom 0.152: F.MX1 114.76,49.64 D35.A
N$35
  Bottom 0.152: G.MX1 133.93,49.64 D36.A
N$36
  Bottom 0.152: H.MX1 153.17,49.64 150.7,47.16 D37.A
N$37
  Bottom 0.152: J.MX1 172.2,49.64 D38.A
N$38
  Bottom 0.152: K.MX1 191.25,49.64 D39.A
N$39
  Bottom 0.152: L.MX1 210.3,49.64 D40.A
N$40
  Bottom 0.152: SEMICOLON.MX1 229.35,49.64 D41.A
N$41
  Bottom 0.152: QUOTE.MX1 248.4,49.64 D42.A
N$42
  Bottom 0.152: ENTER.MX1 276.25,49.64 D43.A
N$43
  Bottom 0.152: PGUP.MX1 304.81,49.64 D44.A
N$44
  Bottom 0.152: LSHIFT.MX1 31.51,29.92 31.51,26.5 D45.A
N$45
  Bottom 0.152: Z.MX1 60.12,29.88 60.12,26.55 D46.A
N$46
  Bottom 0.152: X.MX1 79.17,29.88 79.17,26.44 D47.A
N$47
  Bottom 0.152: C.MX1 98.2,29.9 98.2,26.53 D48.A
N$48
  Bottom 0.152: V.MX1 117.27,29.88 117.27,26.46 D49.A
N$49
  Bottom 0.152: B.MX1 136.33,29.87 136.33,26.46 D50.A
N$50
  Bottom 0.152: N.MX1 155.33,29.92 155.33,26.46 D51.A
N$51
  Bottom 0.152: M.MX1 174.41,29.89 174.41,26.48 D52.A
N$52
  Bottom 0.152: COMMA.MX1 190.98,30.59 D53.A
N$53
  Bottom 0.152: FULLSTOP.MX1 210.33,30.59 207.48,27.74 D54.A
N$54
  Bottom 0.152: FORWARDSLASH.MX1 229.38,30.59 226.39,27.6 D55.A
N$55
  Bottom 0.152: UP.MX1 287.41,29.99 285.94,29.99 284.8,28.85 284.8,27.84 D57.A
N$56
  Bottom 0.152: PGDN.MX1 306.46,29.99 304.99,29.99 303.85,28.85 303.85,27.84 D58.A
N$57
  Bottom 0.152: RSHIFT.MX1 260.11,29.92 260.11,25.72 D56.A
N$58
  Bottom 0.152: LCTRL.MX1 24.26,12.11 D59.A
N$59
  Bottom 0.152: LGUI.MX1 48.07,12.11 D60.A
N$60
  Bottom 0.152: ALT.MX1 71.88,12.11 D61.A
N$61
  Bottom 0.152: SPACEBAR.MX1 143.35,12.14 152.55,12.14 D62.A
N$62
  Bottom 0.152: D63.A FN.MX1
N$63
  Bottom 0.152: D64.A RCTRL.MX1
N$64
  Bottom 0.152: D65.A RGUI.MX1
N$65
  Bottom 0.152: D66.A LEFT.MX1
N$66
  Bottom 0.152: D67.A DOWN.MX1
N$67
  Bottom 0.152: D68.A RIGHT.MX1
N$68
  Bottom 0.152: RBRACE.MX1 260.11,68.02 260.11,64.02 D17.A
N$69  (1 unrouted)
N$70  (3 unrouted)
N$71  (3 unrouted)
N$72  (1 unrouted)
N$73  (2 unrouted)
N$74  (4 unrouted)
N$75  (3 unrouted)
N$76  (3 unrouted)
N$77  (2 unrouted)
N$80  (5 unrouted)
N$81  (3 unrouted)
R0  (1 unrouted)
  Bottom 0.152: D15.C 297.6,75.98 295.48,73.87 292.9,73.87 290.79,75.98 D14.C 273.67,75.85 271.68,73.86 269.12,73.86 267,75.98 D13.C D12.C D11.C D10.C D9.C D8.C D7.C D6.C D5.C D4.C D3.C D2.C D1.C
R1  (1 unrouted)
  Bottom 0.152: D16.C D18.C D19.C D20.C D21.C D22.C D23.C D24.C D25.C D26.C D27.C D28.C 247.83,56.78 D17.C D29.C 290.32,56.73 313.69,56.73 D30.C
R2  (1 unrouted)
  Bottom 0.152: D31.C 41.73,41.95 47.83,41.95 49.95,39.83 D32.C 61.79,39.89 D33.C 99.76,39.89 D34.C 100.05,40.06 D35.C 137.79,40.06 D36.C 156.74,39.97 D37.C 175.9,39.69 176.04,39.83 | D38.C 176.04,39.83 | 176.04,39.83 D39.C D40.C D41.C 252.07,39.83 | 252.07,39.83 D42.C | D44.C 309.31,40.51 297.22,40.51 297.22,40.58 295.84,41.96 292.91,41.96 291.43,40.48 D43.C 273.29,40.48 271.81,41.96 268.93,41.96 266.78,39.82 252.08,39.82 252.07,39.83
R3  (1 unrouted)
  Bottom 0.152: D58.C D57.C 279.62,19.88 276.45,16.72 273.66,16.72 271.58,18.79 266.83,18.79 D56.C 254.73,18.78 252.58,16.63 249.76,16.63 245.77,20.63 D55.C D54.C 213.81,20.99 D53.C D52.C D51.C D50.C D49.C D48.C 99.3,18.88 97.84,20.33 95.27,20.33 93.8,18.86 85.74,18.86 D47.C D46.C 49.99,18.88 47.83,16.72 45.22,16.72 43.06,18.88 D45.C
R4  (1 unrouted)
  Bottom 0.152: D59.C D60.C D61.C D62.C 203.16,4.65 209.07,2.16 | 209.07,2.16 228.23,2.16 D64.C D65.C D66.C D67.C D68.C | 209.07,2.16 D63.C
VBUS  (16 unrouted)
VCC  (3 unrouted)